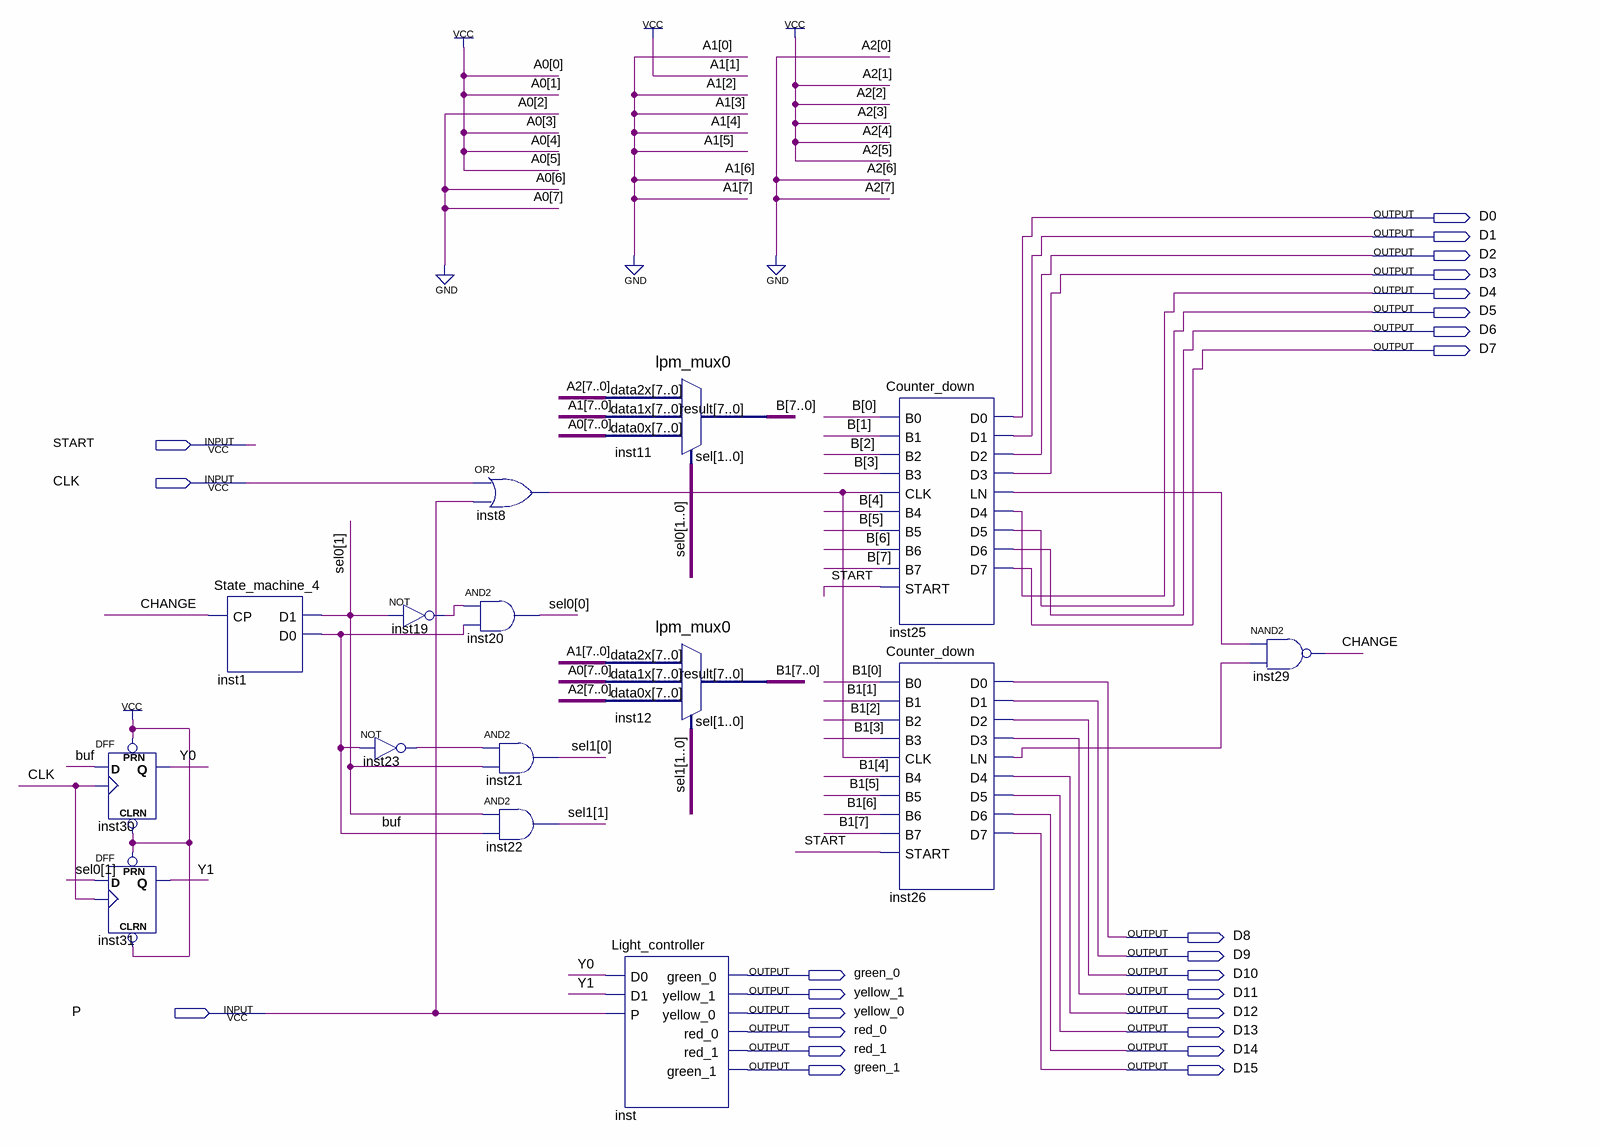
[diagram p0: schematic sheet]
// Quartus schematic Traffic_Light_1.bdf as structural Verilog: 15 symbols, 25 pins
module Traffic_Light_1 (
  input  START,
  input  CLK,
  input  P,
  output D0,
  output D1,
  output D2,
  output D3,
  output D4,
  output D5,
  output D6,
  output D7,
  output D8,
  output D9,
  output green_0,
  output D10,
  output yellow_1,
  output D11,
  output yellow_0,
  output D12,
  output red_0,
  output D13,
  output red_1,
  output D14,
  output green_1,
  output D15
);

  wire \buf , CHANGE, inst8_out, inst19_out, inst23_out, inst25_ln, inst26_ln, Y0, Y1;
  wire [1:0] sel0, sel1;
  wire [7:0] B, B1;

  DFF inst30 (.CLRN(1'b1), .CLK(CLK), .D(\buf ), .PRN(1'b1), .Q(Y0));
  DFF inst31 (.CLRN(1'b1), .CLK(CLK), .D(sel0[1]), .PRN(1'b1), .Q(Y1));
  State_machine_4 inst1 (.CP(CHANGE), .D1(sel0[1]), .D0(\buf ));
  not inst19 (inst19_out, sel0[1]);
  not inst23 (inst23_out, \buf );
  or inst8 (inst8_out, CLK, P);
  and inst20 (sel0[0], inst19_out, \buf );
  and inst21 (sel1[0], inst23_out, sel0[1]);
  and inst22 (sel1[1], sel0[1], \buf );
  lpm_mux0 inst11 (.data2x(8'b00111110), .data1x(8'b00000010), .data0x(8'b00111011), .sel(sel0), .result(B));
  lpm_mux0 inst12 (.data2x(8'b00000010), .data1x(8'b00111011), .data0x(8'b00111110), .sel(sel1), .result(B1));
  Light_controller inst (
    .D0(Y0), .D1(Y1), .P(P), .green_0(green_0), .yellow_1(yellow_1), .yellow_0(yellow_0), .red_0(red_0),
    .red_1(red_1), .green_1(green_1));
  Counter_down inst25 (
    .B0(B[0]), .B1(B[1]), .B2(B[2]), .B3(B[3]), .CLK(inst8_out), .B4(B[4]), .B5(B[5]), .B6(B[6]), .B7(B[7]),
    .START(START), .D0(D0), .D1(D1), .D2(D2), .D3(D3), .LN(inst25_ln), .D4(D4), .D5(D5), .D6(D6), .D7(D7));
  Counter_down inst26 (
    .B0(B1[0]), .B1(B1[1]), .B2(B1[2]), .B3(B1[3]), .CLK(inst8_out), .B4(B1[4]), .B5(B1[5]), .B6(B1[6]),
    .B7(B1[7]), .START(START), .D0(D8), .D1(D9), .D2(D10), .D3(D11), .LN(inst26_ln), .D4(D12), .D5(D13),
    .D6(D14), .D7(D15));
  nand inst29 (CHANGE, inst25_ln, inst26_ln);
endmodule
